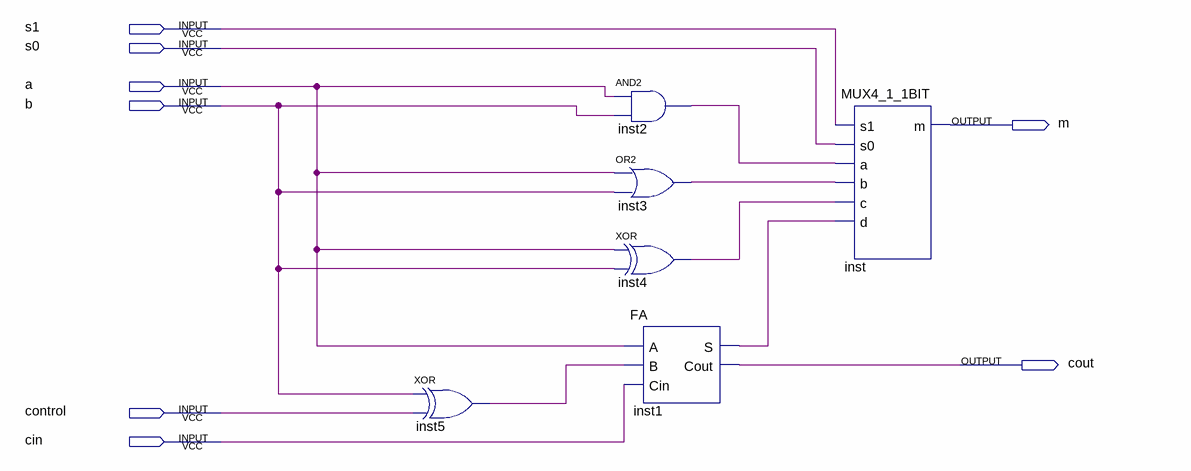
[diagram p0: schematic sheet]
// Quartus schematic ALU1BIT_4CN.bdf as structural Verilog: 6 symbols, 8 pins
module ALU1BIT_4CN (
  input  s1,
  input  s0,
  input  a,
  input  b,
  input  control,
  input  cin,
  output m,
  output cout
);

  wire inst1_s, inst2_out, inst3_out, inst4_out, inst5_out;

  xor inst5 (inst5_out, b, control);
  and inst2 (inst2_out, a, b);
  or inst3 (inst3_out, a, b);
  xor inst4 (inst4_out, a, b);
  FA inst1 (.A(a), .B(inst5_out), .Cin(cin), .S(inst1_s), .Cout(cout));
  MUX4_1_1BIT inst (.s1(s1), .s0(s0), .a(inst2_out), .b(inst3_out), .c(inst4_out), .d(inst1_s), .m(m));
endmodule
